# EAGLE design scaler (EAGLE 5.06)
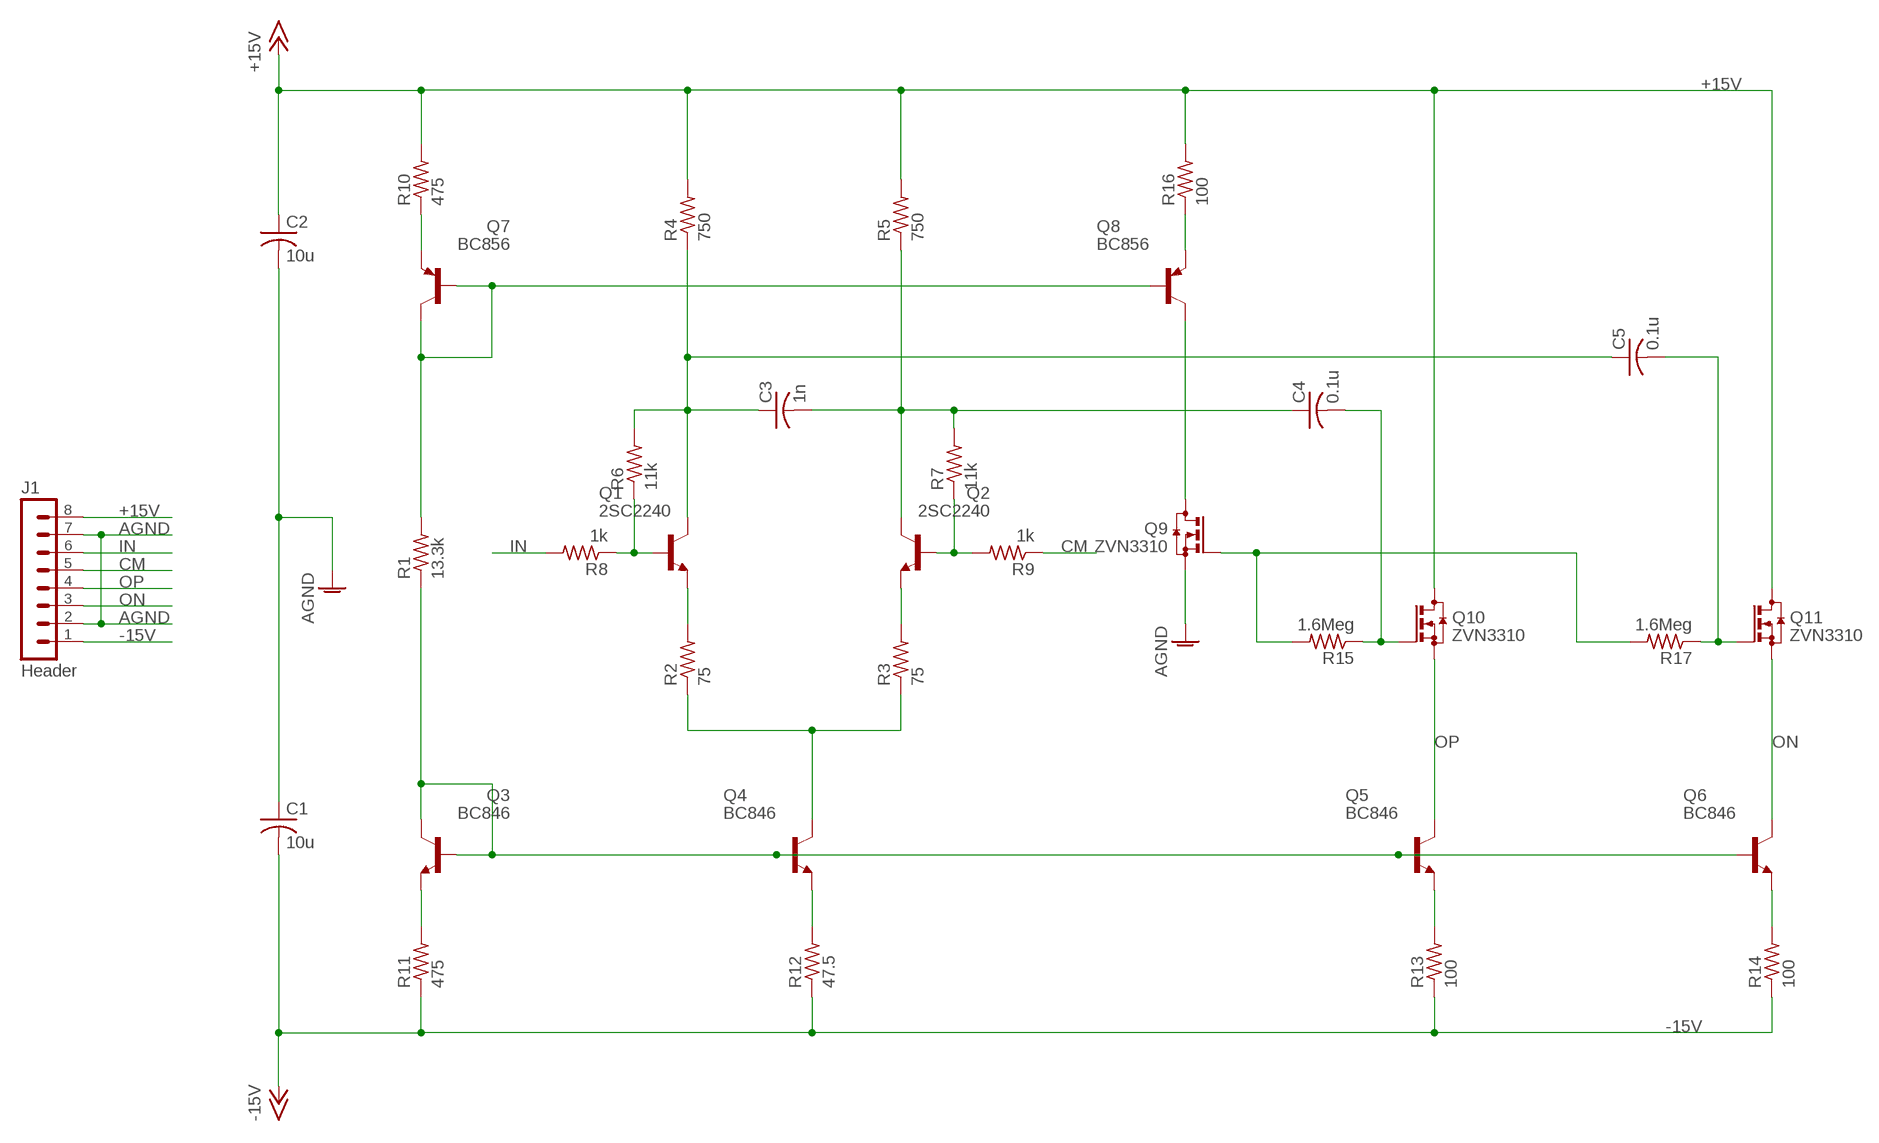
[diagram p0: schematic, sheet 1]

## Parts
C1  10u  C-USC1812  [C1812]
C2  10u  C-USC1812  [C1812]
C3  1n  C-USC1206  [C1206]
C4  0.1u  C-USC1812  [C1812]
C5  0.1u  C-USC1812  [C1812]
J1  Header  MA08-1  [MA08-1]
Q1  2SC2240  [TO92-ECB]
Q2  2SC2240  [TO92-ECB]
Q3  BC846  [SOT23]
Q4  BC846  [SOT23]
Q5  BC846  [SOT23]
Q6  BC846  [SOT23]
Q7  BC856  BC856BSMD  [SOT23-BEC]
Q8  BC856  BC856BSMD  [SOT23-BEC]
Q9  ZVN3310  BSS123  [SOT23]
Q10  ZVN3310  BSS123  [SOT23]
Q11  ZVN3310  BSS123  [SOT23]
R1  13.3k  R-US_R1206  [R1206]
R2  75  R-US_R1206  [R1206]
R3  75  R-US_R1206  [R1206]
R4  750  R-US_R1206  [R1206]
R5  750  R-US_R1206  [R1206]
R6  11k  R-US_R1206  [R1206]
R7  11k  R-US_R1206  [R1206]
R8  1k  R-US_R1206  [R1206]
R9  1k  R-US_R1206  [R1206]
R10  475  R-US_R1206  [R1206]
R11  475  R-US_R1206  [R1206]
R12  47.5  R-US_R1206  [R1206]
R13  100  R-US_R1206  [R1206]
R14  100  R-US_R1206  [R1206]
R15  1.6Meg  R-US_R1206  [R1206]
R16  100  R-US_R1206  [R1206]
R17  1.6Meg  R-US_R1206  [R1206]

## Nets
+15V: C2.1 J1.8 Q10.3(D) Q11.3(D) R4.2 R5.2 R10.2 R16.2
-15V: C1.2 J1.1 R11.1 R12.1 R13.1 R14.1
AGND: C1.1 C2.2 J1.2 J1.7 Q9.2(S)
CM: J1.5 R9.1
IN: J1.6 R8.2
N$1: Q3.1(B) Q3.3(C) Q4.1(B) Q5.1(B) Q6.1(B) R1.1
N$2: Q7.B Q7.C Q8.B R1.2
N$3: Q7.E R10.1
N$4: Q3.2(E) R11.2
N$5: C3.1 C5.1 Q1.C R4.1 R6.2
N$6: Q4.2(E) R12.2
N$7: Q5.2(E) R13.2
N$8: Q6.2(E) R14.2
N$9: C4.2 Q10.1(G) R15.1
N$11: C3.2 C4.1 Q2.C R5.1 R7.2
N$12: Q1.E R2.2
N$13: Q2.E R3.2
N$14: Q4.3(C) R2.1 R3.1
N$15: Q1.B R6.1 R8.1
N$16: Q2.B R7.1 R9.2
N$17: Q8.C Q9.3(D)
N$19: Q8.E R16.1
N$21: Q9.1(G) R15.2 R17.2
N$23: C5.2 Q11.1(G) R17.1
ON: J1.3 Q6.3(C) Q11.2(S)
OP: J1.4 Q5.3(C) Q10.2(S)

## Library data of the parts
C1-C5 = rcl:C-US: CAPACITOR, American symbol
J1 = con-lstb:MA08-1: PIN HEADER
Q1 Q2 = cdp:2SC2240: NPN Silicon Epitaxial Planar Transistor Source: SEMTECH ELECTRONICS LTD. ... 2SC945 2.pdf
Q3-Q6 = transistor:BC846: NPN TRANSISTOR
Q7 Q8 = transistor-pnp:BC856*: PNP Transistror
Q9-Q11 = transistor-small-signal:BSS123: N-CHANNEL MOS FET
R1-R17 = rcl:R-US_: RESISTOR, American symbol

## Board
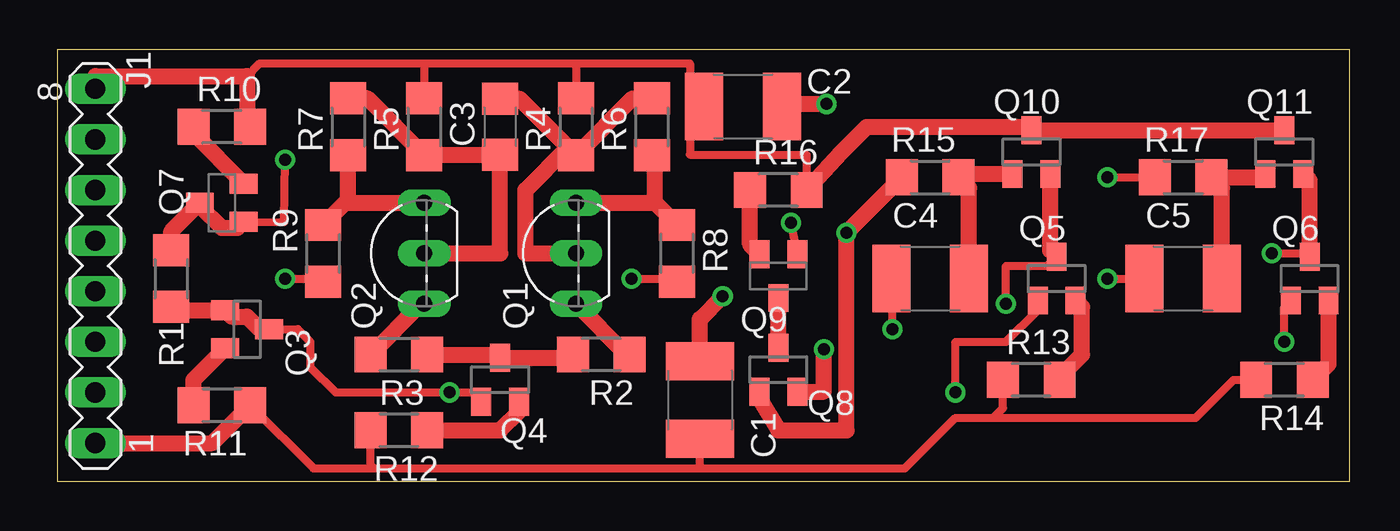
[diagram p1: board, top side]
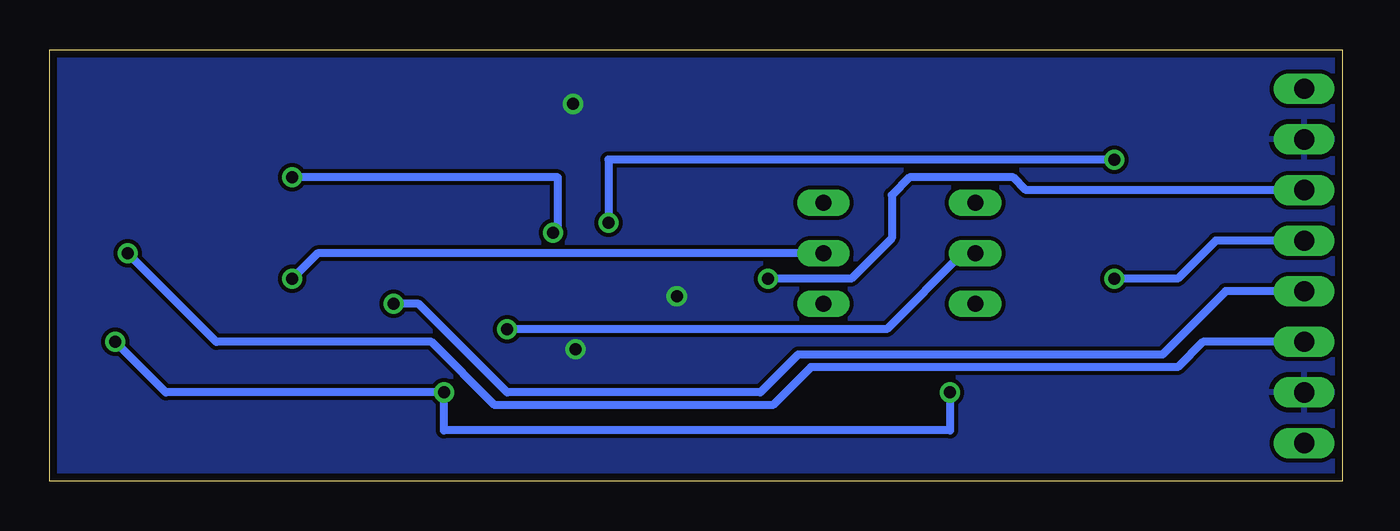
[diagram p2: board, bottom side, seen from below]

Size 64.88 x 21.64 mm. Coordinates in mm from the lower left corner, seen from the top.
Outline: 0,0 64.88,0 64.88,21.64 0,21.64 0,0
Copper layers (1*16): Top 0.035mm / dielectric 1.5mm / Bottom 0.035mm
Design rules "8mils": minimum track width 10mil, minimum drill 15mil, track to track 8mil, track to pad 8mil, pad to pad 8mil, via to via 8mil, smd to smd 8mil, copper to edge 15mil, drill to drill 8mil, minimum pad ring 10mil, minimum via ring 8mil, stop-mask expansion 4mil, vias tented up to drill 0mil, thermal gap 10mil

### Footprints (pad centres in the part's own frame; a part is rotated, then mirrored left to right if it is on the bottom)
C1812 = smd 1.9 x 3.4: 1 -1.95,0; 2 1.95,0
C1206 = smd 1.6 x 1.8: 1 -1.4,0; 2 1.4,0
MA08-1 = drill 1.016 long: 1 -8.89,0; 2 -6.35,0; 3 -3.81,0; 4 -1.27,0; 5 1.27,0; 6 3.81,0; 7 6.35,0; 8 8.89,0
TO92-ECB = drill 0.813 long: B 2.54,0; C 0,0; E -2.54,0
SOT23 = smd 1 x 1.4: 1 -0.95,-1.1; 2 0.95,-1.1; 3 0,1.1
SOT23-BEC = smd 1 x 1.4: B -0.95,-1.1; C 0,1.1; E 0.95,-1.1
R1206 = smd 1.6 x 1.803: 1 -1.422,0; 2 1.422,0

### Placement (x,y rotation side)
C1  32.26,4.06 270 top
C2  34.42,18.8 0 top
C3  22.23,17.78 270 top
C4  43.81,10.16 0 top
C5  56.52,10.16 0 top
J1  1.91,10.79 90 top
Q1  26.04,11.43 90 top
Q2  18.41,11.43 90 top
Q3  9.53,7.62 270 top
Q4  22.23,5.08 0 top
Q5  50.16,10.16 0 top
Q6  62.87,10.16 0 top
Q7  8.26,13.97 90 top
Q8  36.2,10.29 180 top
Q9  36.2,5.59 0 top
Q10  48.9,16.51 0 top
Q11  61.59,16.51 0 top
R1  5.71,10.16 90 top
R2  27.3,6.35 0 top
R3  17.14,6.35 180 top
R4  26.04,17.78 90 top
R5  18.41,17.78 90 top
R6  29.84,17.78 90 top
R7  14.61,17.78 90 top
R8  31.11,11.43 270 top
R9  13.34,11.43 90 top
R10  8.26,17.78 0 top
R11  8.26,3.81 180 top
R12  17.14,2.54 0 top
R13  48.9,5.08 0 top
R14  61.59,5.08 0 top
R15  43.81,15.24 180 top
R16  36.2,14.61 0 top
R17  56.52,15.24 180 top

### Tracks (layer width: path | path; a pad name or v marks a point on that pad's centre or on a via)
+15V
  Top 0.406: R16.2 37.62,16.36 37.47,16.38 31.75,16.38 31.75,19.68 | 31.75,19.68 31.75,20.95 26.04,20.95 | 18.41,20.95 26.04,20.95 | 18.41,20.95 R5.2 | 26.04,20.95 R4.2 | 18.41,20.95 10.16,20.95 9.53,20.32 | C2.1 32.47,18.97 31.75,19.68
  Top 0.813: Q11.3 Q10.3 48.73,17.78 40.64,17.78 39.37,16.51 R16.2 | R10.2 9.53,17.93 9.53,20.19 9.46,20.26 9.53,20.32 1.91,20.32 J1.8 | R5.2 18.41,19.05
-15V
  Top 0.406: R14.1 59.05,5.08 57.15,3.17 46.99,3.17 | 46.99,3.17 45.09,3.17 42.55,0.64 32.13,0.64 | 15.88,0.64 12.85,0.64 R11.1 | 15.88,0.64 32.13,0.64 | R12.1 15.72,0.79 15.88,0.64 | R13.1 47.47,3.66 46.99,3.17 | C1.2 32.26,0.76 32.13,0.64
  Top 0.813: J1.1 7.77,1.91 R11.1
AGND  (via drill 0.6)
  Top 0.813: Q9.2 38.48,4.49 v38.48,6.6 | C1.1 32.26,8.13 v33.4,9.27 | C2.2 36.45,18.8 36.58,18.92 v38.61,18.92
  pour Bottom: 0,0 64.77,0 64.77,21.59 0,21.59
CM  (via drill 0.6)
  Top 0.406: v11.43,10.16 13.18,10.16 R9.1
  Bottom 0.406: J1.5 6.35,12.06 8.26,10.16 v11.43,10.16
IN  (via drill 0.6)
  Top 0.406: v28.83,10.16 30.96,10.16 R8.2
  Bottom 0.406: J1.6 15.88,14.61 16.51,15.24 21.72,15.24 22.61,14.35 22.61,12.19 24.64,10.16 v28.83,10.16
N$1  (via drill 0.6)
  Top 0.406: Q3.3 12.06,7.62 12.7,6.99 12.7,5.71 13.97,4.45 v19.68,4.45 20.81,4.45 Q4.1 | v61.59,6.99 61.59,8.74 Q6.1 | Q5.1 49.22,8.57 47.62,6.99 45.09,6.99 v45.09,4.45
  Top 0.813: Q3.3 10.16,7.62 9.53,8.26 8.74,8.26 Q3.1 5.88,8.57 R1.1
  Bottom 0.406: v19.68,4.45 19.68,2.54 45.09,2.54 v45.09,4.45 59.05,4.45 v61.59,6.99
N$2  (via drill 0.6)
  Top 0.406: Q7.C 7.16,13.8 | Q7.B 11.39,13 v11.43,16.13 | v36.83,12.95 36.83,12.85 Q8.B
  Top 0.813: R1.2 5.71,12.53 Q7.C | 7.16,13.8 8.26,12.7 9.04,12.7 Q7.B
  Bottom 0.406: v11.43,16.13 36.83,16.13 v36.83,12.95
N$3
  Top 0.813: R10.1 6.83,17.44 Q7.E
N$4
  Top 0.813: R11.2 6.83,5.08 Q3.2
N$5  (via drill 0.6)
  Top 0.406: v52.7,10.16 C5.1 54.61,10.16
  Top 0.813: R6.2 28.88,19.2 R4.1 25.64,16.75 | C3.1 23.21,19.18 25.64,16.75 | Q1.C 23.5,11.43 23.5,14.61 25.64,16.75
  Bottom 0.406: Q1.C 51.44,11.43 v52.7,10.16
N$6
  Top 0.813: Q4.2 23.18,3.49 22.23,2.54 R12.2
N$7
  Top 0.813: R13.2 50.32,5.23 51.44,6.35 51.44,8.74 Q5.2
N$8
  Top 0.813: Q6.2 63.81,5.88 R14.2
N$9
  Top 0.813: Q10.1 45.41,15.41 R15.1 45.77,14.71 C4.2
N$11  (via drill 0.6)
  Top 0.406: v41.91,7.62 41.91,10.12 C4.1
  Top 0.813: Q2.C 22.23,11.43 C3.2 22.2,16.36 R5.1 15.57,19.2 R7.2
  Bottom 0.406: Q2.C 19.05,11.43 22.86,7.62 v41.91,7.62
N$12
  Top 0.813: R2.2 28.57,6.35 Q1.E
N$13
  Top 0.813: Q2.E 18.26,8.89 R3.2
N$14
  Top 0.813: R3.1 22.05,6.35 Q4.3 25.71,6.18 R2.1
N$15
  Top 0.813: Q1.B 30,13.97 | 30,13.97 R8.1 | 30,13.97 30,16.21 R6.1
N$16
  Top 0.813: 14.61,13.97 14.45,13.97 R9.2 | 14.61,13.97 Q2.B | 14.61,13.97 R7.1
N$17
  Top 0.813: Q9.3 Q8.C
N$19
  Top 0.813: R16.1 34.77,11.86 Q8.E
N$21  (via drill 0.6)
  Top 0.406: v52.7,15.24 R17.2
  Top 0.813: Q9.1 35.24,4.12 36.2,2.54 39.62,2.54 39.62,12.34 v39.61,12.46 R15.2
  Bottom 0.406: v52.7,15.24 39.37,15.24 39.37,12.7 v39.61,12.46
N$23
  Top 0.813: Q11.1 60.48,15.24 R17.1 58.47,14.71 C5.2
ON  (via drill 0.6)
  Top 0.406: v60.96,11.43 62.7,11.43 Q6.3
  Top 0.813: Q6.3 62.87,15.09 Q11.2
  Bottom 0.406: J1.3 6.99,6.99 8.26,5.71 26.67,5.71 28.57,3.81 42.55,3.81 45.72,6.99 56.52,6.99 v60.96,11.43
OP  (via drill 0.6)
  Top 0.406: v47.62,8.89 47.62,10.79 49.7,10.79 Q5.3
  Top 0.813: Q10.2 49.84,11.58 Q5.3
  Bottom 0.406: J1.4 5.84,9.53 9.02,6.35 27.3,6.35 29.21,4.45 41.91,4.45 46.35,8.89 v47.62,8.89